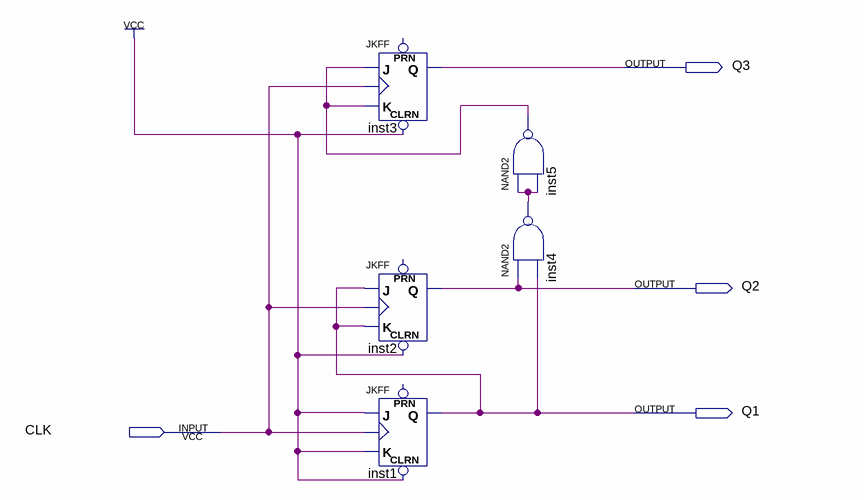
[diagram p0: schematic sheet]
// Quartus schematic count.bdf as structural Verilog: 5 symbols, 4 pins
module count (
  input  CLK,
  output Q3,
  output Q2,
  output Q1
);

  wire inst4_out, inst5_out;

  JKFF inst3 (.CLRN(1'b1), .K(inst5_out), .J(inst5_out), .CLK(CLK), .Q(Q3));  // open: PRN
  JKFF inst2 (.CLRN(1'b1), .K(Q1), .J(Q1), .CLK(CLK), .Q(Q2));  // open: PRN
  JKFF inst1 (.CLRN(1'b1), .K(1'b1), .J(1'b1), .CLK(CLK), .Q(Q1));  // open: PRN
  nand inst5 (inst5_out, inst4_out, inst4_out);
  nand inst4 (inst4_out, Q2, Q1);
endmodule
